# Altium schematic sheet Tubes.SchDoc
size A3; Size: A3; SheetNumber: 1; SheetTotal: 1
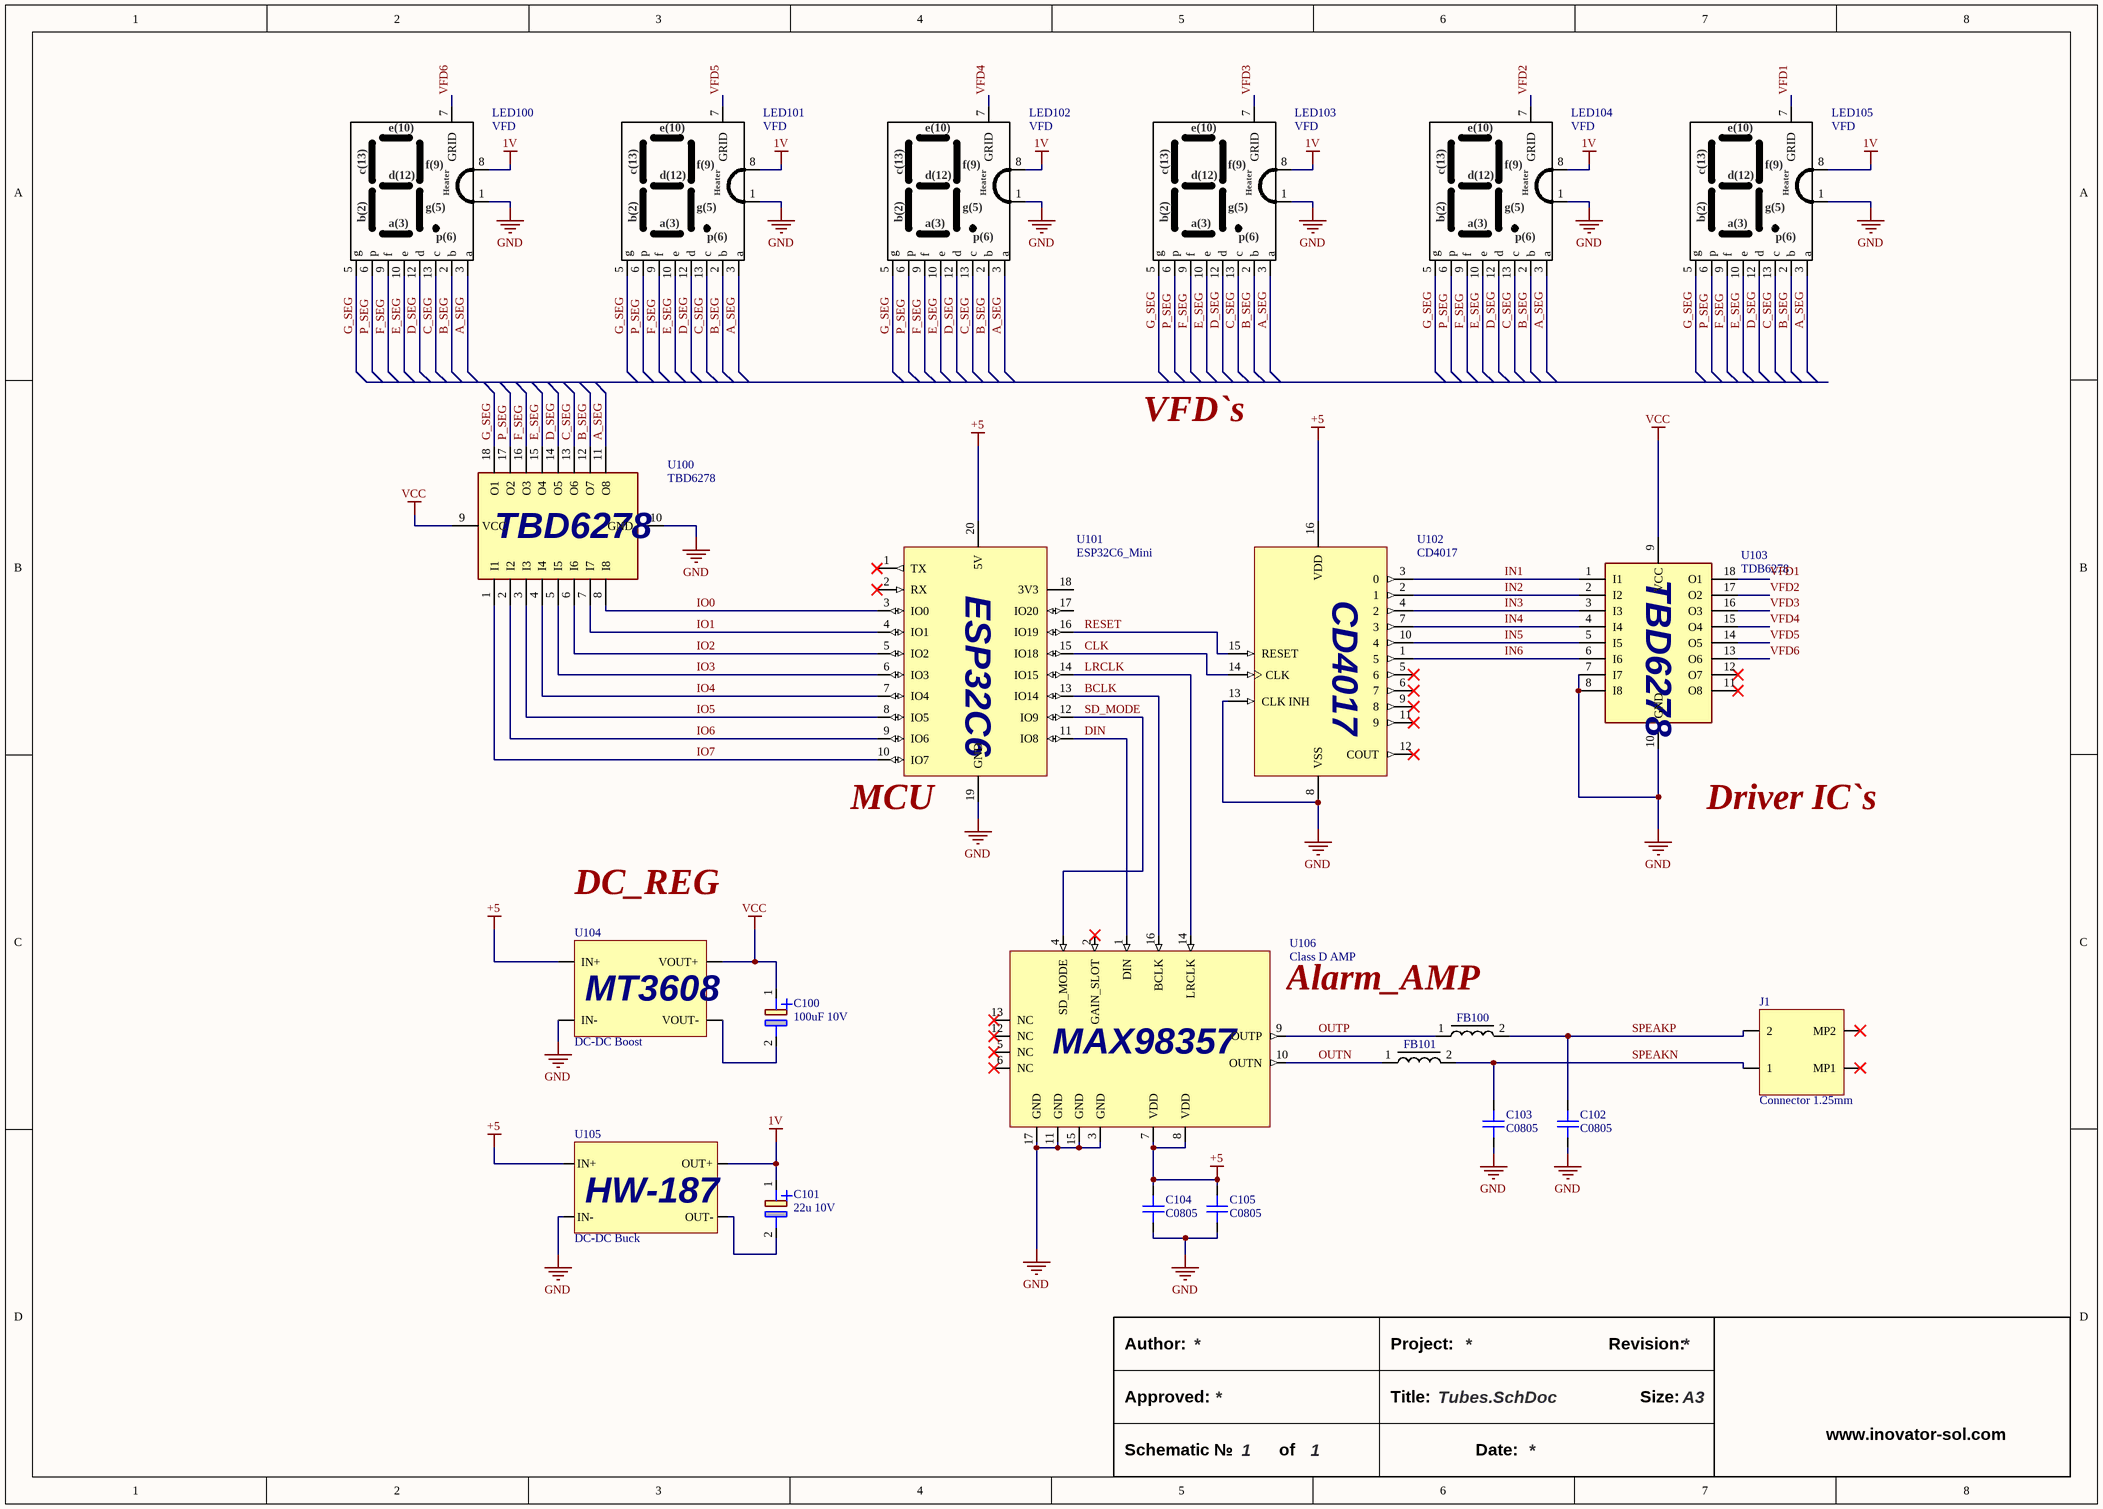
[diagram p0: Tubes.SchDoc]

## Parts
?  (no value)
C100  100uF 10V  [CAP_100u_10V_PRD250W50D630H800]
C101  22u 10V  [CAP_D4mm_LS1.5mm]
C102  C0805  [CAP_0805]
C103  C0805  [CAP_0805]
C104  C0805  [CAP_0805]
C105  C0805  [CAP_0805]
FB100  FB0805  Ω  [FB_0805]  (value not drawn)
FB101  FB0805  Ω  [FB_0805]  (value not drawn)
J1  Connector 1.25mm  [532610271]
LED100  VFD  [VFD_Tube_IV3]
LED101  VFD  [VFD_Tube_IV3]
LED102  VFD  [VFD_Tube_IV3]
LED103  VFD  [VFD_Tube_IV3]
LED104  VFD  [VFD_Tube_IV3]
LED105  VFD  [VFD_Tube_IV3]
U100  TBD6278  [TBD62783_DIP762W55P254L2286H480Q18N]
U101  ESP32C6_Mini  [ESP32_minimodule - duplicate]
U102  CD4017  [CD4017_N0016A]
U103  TDB6278  [TBD62783_DIP762W55P254L2286H480Q18N]
U104  DC-DC Boost  [boost_mt3608]
U105  DC-DC Buck  [HW-187]
U106  Class D AMP  [TQFN-16_MAX98357]

## Nets
1V: C101.1(+) LED100.8 LED101.8 LED102.8 LED103.8 LED104.8 LED105.8 U105.3(OUT+)
+5: C104.2 C105.2 U101.20(5V) U102.16(VDD) U104.2(IN+) U105.1(IN+) U106.7(VDD) U106.8(VDD)
GND: C102.1 C103.1 C104.1 C105.1 LED100.1 LED101.1 LED102.1 LED103.1 LED104.1 LED105.1 U100.10(GND) U101.19(GND) U102.8(VSS) U102.13(CLK_INH) U103.7(I7) U103.8(I8) U103.10(GND) U104.1(IN-) U105.2(IN-) U106.3(GND) U106.11(GND) U106.15(GND) U106.17(GND)
VCC: C100.1(+) U100.9(VCC) U103.9(VCC) U104.3(VOUT+)
A_SEG: LED100.3(a) LED101.3(a) LED102.3(a) LED103.3(a) LED104.3(a) LED105.3(a) U100.11(O8)
B_SEG: LED100.2(b) LED101.2(b) LED102.2(b) LED103.2(b) LED104.2(b) LED105.2(b) U100.12(O7)
BCLK: U101.13(IO14) U106.16(BCLK)
C_SEG: LED100.13(c) LED101.13(c) LED102.13(c) LED103.13(c) LED104.13(c) LED105.13(c) U100.13(O6)
CLK: U101.15(IO18) U102.14(CLK)
D_SEG: LED100.12(d) LED101.12(d) LED102.12(d) LED103.12(d) LED104.12(d) LED105.12(d) U100.14(O5)
DIN: U101.11(IO8) U106.1(DIN)
E_SEG: LED100.10(e) LED101.10(e) LED102.10(e) LED103.10(e) LED104.10(e) LED105.10(e) U100.15(O4)
F_SEG: LED100.9(f) LED101.9(f) LED102.9(f) LED103.9(f) LED104.9(f) LED105.9(f) U100.16(O3)
G_SEG: LED100.5(g) LED101.5(g) LED102.5(g) LED103.5(g) LED104.5(g) LED105.5(g) U100.18(O1)
IN1: U102.3(0) U103.1(I1)
IN2: U102.2(1) U103.2(I2)
IN3: U102.4(2) U103.3(I3)
IN4: U102.7(3) U103.4(I4)
IN5: U102.10(4) U103.5(I5)
IN6: U102.1(5) U103.6(I6)
IO0: U100.8(I8) U101.3(IO0)
IO1: U100.7(I7) U101.4(IO1)
IO2: U100.6(I6) U101.5(IO2)
IO3: U100.5(I5) U101.6(IO3)
IO4: U100.4(I4) U101.7(IO4)
IO5: U100.3(I3) U101.8(IO5)
IO6: U100.2(I2) U101.9(IO6)
IO7: U100.1(I1) U101.10(IO7)
LRCLK: U101.14(IO15) U106.14(LRCLK)
OUTN: FB101.1 U106.10(OUTN)
OUTP: FB100.1 U106.9(OUTP)
P_SEG: LED100.6(p) LED101.6(p) LED102.6(p) LED103.6(p) LED104.6(p) LED105.6(p) U100.17(O2)
RESET: U101.16(IO19) U102.15(RESET)
SD_MODE: U101.12(IO9) U106.4(SD_MODE)
SPEAKN: C103.2 FB101.2 J1.1
SPEAKP: C102.2 FB100.2 J1.2
VFD1: LED105.7(GRID) U103.18(O1)
VFD2: LED104.7(GRID) U103.17(O2)
VFD3: LED103.7(GRID) U103.16(O3)
VFD4: LED102.7(GRID) U103.15(O4)
VFD5: LED101.7(GRID) U103.14(O5)
VFD6: LED100.7(GRID) U103.13(O6)
NetC100_2: C100.2(-) U104.4(VOUT-)
NetC101_2: C101.2(-) U105.4(OUT-)

Not connected (* = marked no-connect by the designer): J1 MP1* MP2*; U101 1(TX)* 2(RX)* 17(IO20) 18(3V3); U102 5(6)* 6(7)* 9(8)* 11(9)* 12(COUT)*; U103 11(O8)* 12(O7)*; U106 2(GAIN_SLOT)* 5(NC)* 6(NC)* 12(NC)* 13(NC)*

## Notes on the sheet
- VFD`s
- (near U101) MCU
- Driver IC`s
- DC_REG
- (near U106) Alarm_AMP
- Author:
- Project:
- Revision:
- Approved:
- Schematic №
- of
- Title:
- Date:
- Size:
- www.inovator-sol.com <http://www.inovator-sol.com>
- (in symbol ESP32C6_mini_module) ESP32C6
- (in symbol MAX98357AETE+T) MAX98357
- (in symbol MODULE_MT3608) MT3608
- (in symbol TBD62783APG) TBD6278
- (in symbol VFD_Tube_IV3) e(10); f(9); c(13); d(12); Heater; g(5); b(2); a(3); p(6)

## Library data of the parts
? = Title_Block_INOV_small: Title Block for A3 size sheet.
C100 = CAP_100u_10V: Cap Aluminum 100uF 10V 20% (6.3 X 7mm) Radial 2.5mm 80mA 1000 hr 85°C Bulk; Manufacturer: Panasonic; Manufacturer Part Number: ECE-A1AKA101; Supplier: Mouser; Supplier Part Number: 667-ECE-A1AKA101; RoHS: Yes; Category: Aluminum Electrolytic Capacitors; Stock: 46; Pricing: 1=0,21, 10=0,104, 50=0,104, 100=0,06, 1000=0,053, 10000=0,049 (USD); ComponentLink1URL: https://datasheet.ciiva.com/16390/aba0000ce20-16390502.pdf?src-supplier=Future+Electronics; ComponentLink1Description: https://datasheet.ciiva.com/16390/aba0000ce20-16390502.pdf?src-supplier=Future+Electronics; ComponentLink2URL: https://datasheet.ciiva.com/43459/1339511-43459559.pdf?src-supplier=Farnell; ComponentLink2Description: https://datasheet.ciiva.com/43459/1339511-43459559.pdf?src-supplier=Farnell; ComponentLink3URL: https://datasheet.ciiva.com/2984/aba0000ce20-2984487.pdf?src-supplier=Avnet; ComponentLink3Description: https://datasheet.ciiva.com/2984/aba0000ce20-2984487.pdf?src-supplier=Avnet; ComponentLink4URL: https://datasheet.ciiva.com/46397/1339511-46397446.pdf?src-supplier=Element14; ComponentLink4Description: https://datasheet.ciiva.com/46397/1339511-46397446.pdf?src-supplier=Element14
C101 = CAP_22u_10V_ECE-A1AKA220: Cap Aluminum 22uF 10V 20% Radial 1000h 85°C Bulk; Manufacturer: Panasonic; Supplier: Mouser; Supplier Part Number: 667-ECE-A1AKA220; Manufacturer Part Number: ECE-A1AKA220; RoHS: Yes; Category: Aluminum Electrolytic Capacitors; Stock: 1909; Pricing: 1=0,29, 10=0,136, 50=0,136, 100=0,071, 1000=0,056, 10000=0,044 (USD); ComponentLink1URL: https://datasheet.ciiva.com/46451/1339511-46451258.pdf?src-supplier=Element14; ComponentLink1Description: https://datasheet.ciiva.com/46451/1339511-46451258.pdf?src-supplier=Element14; ComponentLink2URL: https://datasheet.ciiva.com/30183/aba0000ce20-30183486.pdf?src-supplier=Onlinecomponents.com; ComponentLink2Description: https://datasheet.ciiva.com/30183/aba0000ce20-30183486.pdf?src-supplier=Onlinecomponents.com; ComponentLink3URL: https://datasheet.ciiva.com/2984/aba0000ce20-2984488.pdf?src-supplier=Avnet; ComponentLink3Description: https://datasheet.ciiva.com/2984/aba0000ce20-2984488.pdf?src-supplier=Avnet
C102-C105 = CAP_0805: Capacitor SMD 0805; Manufacturer: *; Manufacturer Part Number: *; Distributor Link: *; LCSC: *; Rating: *; Dielectric: *
FB100 FB101 = FB_0805: Ferrite Bead SMD 0805; Manufacturer: *; Manufacturer Part Number: *; Distributor Link: *; LCSC: *
J1 = 53261-0271: 1.25mm Pitch PicoBlade™ Header, Surface Mount, Right Angle, Lead-Free, 2 Circuits; Manufacturer: Molex; Manufacturer Lifecycle Status: ACTIVE; Contact Resistance: 20mΩ; Current Rating: 5.5A; Gender: Male; Glow Wire Compliant: Non-compliant; Insulation Resistance: 100MΩ; Number of Circuits: 2; Plating: Tin; Plating Thickness: 990.6nm; Voltage Rating: 125V; Supplier: Mouser; Supplier Part Number: 538-53261-0271; Manufacturer Part Number: 53261-0271; RoHS: Compliant; Category: Headers and Wire Housings; Stock: 82573; Pricing: 1=0,51, 10=0,455, 50=0,436, 100=0,387, 1000=0,301, 10000=0,27 (USD); China RoHS: Compliant; Color: Beige; Contact Gender: Male; Contact Plating: Tin; Country of Origin: SG; Flammability Rating: UL94 V-0; Height: 3.4mm; Housing Material: Nylon; Lead Free: Lead Free; Lead Pitch: 1.25mm; Length: 7.65mm; Lifecycle Status: Production; Max Operating Temperature: 105°C; Min Operating Temperature: -40°C; Mounting Technology: Surface Mount; Number of Contacts: 2; Pins: 2; Number of Positions: 2; Number of Rows: 1; Orientation: Right Angle; Packaging: Cut Tape; Pitch: 1.25mm; Radiation Hardening: No; REACH SVHC: Yes; Schedule B: 8536694040, 8536694040|8536694040|8536694040|8536694040|8536694040|8536694040|8536694040|8536694040|8536694040|8536694040|8536694040|8536694040|8536694040|8536694040|8536694040|8536694040|8536694040|8536694040|8536694040|8536694040|8536694040|8536694040|8536694040|85; Terminal Pitch: 1.25mm; Termination: SMD/SMT, Solder; Voltage Rating (AC): 125V; Voltage Rating (DC): 125V; Width: 4.2mm; Working Voltage: 125V; ComponentLink1URL: https://datasheet.octopart.com:443/53261-0271-Molex-datasheet-8522546.pdf?src-supplier=Master+Electronics; ComponentLink1Description: https://datasheet.octopart.com:443/53261-0271-Molex-datasheet-8522546.pdf?src-supplier=Master+Electronics; ComponentLink2URL: https://datasheet.octopart.com:443/53261-0271-Molex-datasheet-177725531.pdf?src-supplier=IHS; ComponentLink2Description: https://datasheet.octopart.com:443/53261-0271-Molex-datasheet-177725531.pdf?src-supplier=IHS; ComponentLink3URL: https://datasheet.octopart.com:443/53261-0271-Molex-datasheet-8343080.pdf?src-supplier=Future+Electronics; ComponentLink3Description: https://datasheet.octopart.com:443/53261-0271-Molex-datasheet-8343080.pdf?src-supplier=Future+Electronics; ComponentLink4URL: https://datasheet.octopart.com:443/532610271-Molex-datasheet-137316104.pdf?src-supplier=Future+Electronics; ComponentLink4Description: https://datasheet.octopart.com:443/532610271-Molex-datasheet-137316104.pdf?src-supplier=Future+Electronics; ComponentLink5URL: https://datasheet.octopart.com:443/53261-0271-Molex-datasheet-8331727.pdf?src-supplier=Molex; ComponentLink5Description: https://datasheet.octopart.com:443/53261-0271-Molex-datasheet-8331727.pdf?src-supplier=Molex; ComponentLink6URL: https://sigma.octopart.com:443/16413759/technical_drawing/Molex-532610271.pdf?src-supplier=Molex; ComponentLink6Description: https://sigma.octopart.com:443/16413759/technical_drawing/Molex-532610271.pdf?src-supplier=Molex; ComponentLink7URL: https://datasheet.octopart.com:443/532610271-Molex-datasheet-13786009.pdf?src-supplier=Sager+Electronics; ComponentLink7Description: https://datasheet.octopart.com:443/532610271-Molex-datasheet-13786009.pdf?src-supplier=Sager+Electronics; ComponentLink8URL: https://datasheet.octopart.com:443/53261-0271-Molex-datasheet-14711292.pdf?src-supplier=element14+APAC; ComponentLink8Description: https://datasheet.octopart.com:443/53261-0271-Molex-datasheet-14711292.pdf?src-supplier=element14+APAC; ComponentLink9URL: https://datasheet.octopart.com:443/53261-0271-Molex-datasheet-101583399.pdf?src-supplier=Farnell; ComponentLink9Description: https://datasheet.octopart.com:443/53261-0271-Molex-datasheet-101583399.pdf?src-supplier=Farnell; ComponentLink10URL: https://datasheet.octopart.com:443/53261-0271.-Molex-datasheet-77558175.pdf?src-supplier=Farnell; ComponentLink10Description: https://datasheet.octopart.com:443/53261-0271.-Molex-datasheet-77558175.pdf?src-supplier=Farnell; ComponentLink11URL: https://datasheet.octopart.com:443/53261-0271-Molex-datasheet-11023919.pdf?src-supplier=Farnell; ComponentLink11Description: https://datasheet.octopart.com:443/53261-0271-Molex-datasheet-11023919.pdf?src-supplier=Farnell; ComponentLink12URL: https://datasheet.octopart.com:443/532610271-Molex-datasheet-520094.pdf?src-supplier=Farnell; ComponentLink12Description: https://datasheet.octopart.com:443/532610271-Molex-datasheet-520094.pdf?src-supplier=Farnell; ComponentLink13URL: https://datasheet.octopart.com:443/53261-0271-Molex-datasheet-41177771.pdf?src-supplier=Newark; ComponentLink13Description: https://datasheet.octopart.com:443/53261-0271-Molex-datasheet-41177771.pdf?src-supplier=Newark; ComponentLink14URL: https://datasheet.octopart.com:443/53261-0271-Molex-datasheet-27120403.pdf?src-supplier=Newark; ComponentLink14Description: https://datasheet.octopart.com:443/53261-0271-Molex-datasheet-27120403.pdf?src-supplier=Newark; ComponentLink15URL: https://datasheet.octopart.com:443/53261-0271-Molex-datasheet-140186584.pdf?src-supplier=RS+(Formerly+Allied+Electronics); ComponentLink15Description: https://datasheet.octopart.com:443/53261-0271-Molex-datasheet-140186584.pdf?src-supplier=RS+(Formerly+Allied+Electronics); ComponentLink16URL: https://datasheet.octopart.com:443/53261-0271-Molex-datasheet-120153897.pdf?src-supplier=RS+(Formerly+Allied+Electronics); ComponentLink16Description: https://datasheet.octopart.com:443/53261-0271-Molex-datasheet-120153897.pdf?src-supplier=RS+(Formerly+Allied+Electronics); ComponentLink17URL: https://datasheet.octopart.com:443/53261-0271-Molex-datasheet-34442330.pdf?src-supplier=RS+(Formerly+Allied+Electronics); ComponentLink17Description: https://datasheet.octopart.com:443/53261-0271-Molex-datasheet-34442330.pdf?src-supplier=RS+(Formerly+Allied+Electronics); ComponentLink18URL: https://datasheet.octopart.com:443/53261-0271-Molex-datasheet-27710088.pdf?src-supplier=RS+(Formerly+Allied+Electronics); ComponentLink18Description: https://datasheet.octopart.com:443/53261-0271-Molex-datasheet-27710088.pdf?src-supplier=RS+(Formerly+Allied+Electronics); ComponentLink19URL: https://datasheet.octopart.com:443/53261-0271-Molex-datasheet-62281348.pdf?src-supplier=Electro+Sonic; ComponentLink19Description: https://datasheet.octopart.com:443/53261-0271-Molex-datasheet-62281348.pdf?src-supplier=Electro+Sonic; ComponentLink20URL: https://datasheet.octopart.com:443/53261-0271-Molex-datasheet-23710575.pdf?src-supplier=Electro+Sonic; ComponentLink20Description: https://datasheet.octopart.com:443/53261-0271-Molex-datasheet-23710575.pdf?src-supplier=Electro+Sonic; ComponentLink21URL: https://datasheet.octopart.com:443/53261-0271-Molex-datasheet-26579557.pdf?src-supplier=TME; ComponentLink21Description: https://datasheet.octopart.com:443/53261-0271-Molex-datasheet-26579557.pdf?src-supplier=TME; ComponentLink22URL: https://datasheet.octopart.com:443/53261-0271-Molex-datasheet-17741841.pdf?src-supplier=Jameco; ComponentLink22Description: https://datasheet.octopart.com:443/53261-0271-Molex-datasheet-17741841.pdf?src-supplier=Jameco; ComponentLink23URL: https://datasheet.octopart.com:443/53261-0271-Molex-datasheet-144901.pdf?src-supplier=DigiKey; ComponentLink23Description: https://datasheet.octopart.com:443/53261-0271-Molex-datasheet-144901.pdf?src-supplier=DigiKey; ComponentLink24URL: https://datasheet.octopart.com:443/532-61-0271-Molex-datasheet-100429.pdf?src-supplier=element14; ComponentLink24Description: https://datasheet.octopart.com:443/532-61-0271-Molex-datasheet-100429.pdf?src-supplier=element14; ComponentLink25URL: http://sigma.octopart.com:80/16413755/rohs_statement/Molex-532610271.pdf?src-supplier=Compliance+Statements; ComponentLink25Description: http://sigma.octopart.com:80/16413755/rohs_statement/Molex-532610271.pdf?src-supplier=Compliance+Statements; ComponentLink26URL: http://sigma.octopart.com:80/conflict_mineral_statement/Molex-company-72.pdf?src-supplier=Compliance+Statements; ComponentLink26Description: http://sigma.octopart.com:80/conflict_mineral_statement/Molex-company-72.pdf?src-supplier=Compliance+Statements; ComponentLink27URL: http://sigma.octopart.com:80/rohs_statement/Molex-company-73.pdf?src-supplier=Compliance+Statements; ComponentLink27Description: http://sigma.octopart.com:80/rohs_statement/Molex-company-73.pdf?src-supplier=Compliance+Statements; ComponentLink28URL: http://sigma.octopart.com:80/reach_statement/Molex-company-74.pdf?src-supplier=Compliance+Statements; ComponentLink28Description: http://sigma.octopart.com:80/reach_statement/Molex-company-74.pdf?src-supplier=Compliance+Statements
LED100-LED105 = VFD_Tube_IV3: 96x10.6 mm
U100 U103 = TBD62783APG: Buffer/Inverter Based Peripheral Driver, 1 Driver, 0.4A, DMOS, PDIP18; Manufacturer: Toshiba; Interface: On/Off; Max Output current: 400mA; Max Supply Current: 1.5mA; Max Supply Voltage: 50V; Min Supply Voltage: 2V; Number of Channels: 8; Number of Transmitters: 1; Operating Supply Voltage: 5V; Output Configuration: High Side; Supplier: Mouser; Supplier Part Number: 757-TBD62783APG; Manufacturer Part Number: TBD62783APG; RoHS: Compliant; Category: Power Switch ICs - Power Distribution; Stock: 7346; Pricing: 1=2,34, 10=1,46, 50=1,4, 100=1,35, 1000=1,24, 10000=1,19 (USD); Case/Package: DIP; Height - Seated (Max): 4.8mm; Length: 22.86mm; Lifecycle Status: Production; Max Operating Temperature: 85°C; Min Operating Temperature: -40°C; Number of Circuits: 8; Number of Outputs: 8; Number of Terminals: 18; Output Voltage: 50V; Terminal Pitch: 2.54mm; Width: 7.62mm; ComponentLink1URL: https://datasheet.octopart.com:443/TBD62783APG-Toshiba-datasheet-68329876.pdf?src-supplier=IHS; ComponentLink1Description: https://datasheet.octopart.com:443/TBD62783APG-Toshiba-datasheet-68329876.pdf?src-supplier=IHS; Supplier 1: Mouser; Supplier Part Number 1: 757-TBD62783APG
U101 = ESP32C6_mini_module: ESP32-C6 Super Mini is a development board based on the ESP32C6 microcontroller using RISCV32 architecture.
U102 = CD4017BE: Counter; PDIP; Counter Logic; 3 V to 18 V; -55; +125; 0.04 Ua to 0.08 Ua Icc; 5; Manufacturer: Texas Instruments; Manufacturer Lifecycle Status: ACTIVE; Clock Edge Trigger Type: Positive Edge; Direction: Unidirectional; Frequency: 11MHz; Max Supply Voltage: 18V; Min Supply Voltage: 3V; Number of Bits: 4; Number of Bits per Element: 10; Number of Elements: 1; Output Current: 1.5mA; Propagation Delay: 650ns; Quiescent Current: 100µA; Reset: Asynchronous; Sync/Async: Synchronous; Supplier: Mouser; Supplier Part Number: 595-CD4017BE; Manufacturer Part Number: CD4017BE; RoHS: Compliant; Category: Counters; Stock: 2110; Pricing: 1=1,27, 10=0,925, 50=0,837, 100=0,741, 1000=0,621, 10000=0,581 (USD); Case/Package: PDIP; Contact Plating: Gold; Height: 5.08mm; Lead Free: Lead Free; Length: 19.3mm; Lifecycle Status: Production; Logic Function: Counter; Max Operating Temperature: 125°C; Min Operating Temperature: -55°C; Mounting Technology: Through Hole; Number of Gates: 1; Pins: 16; Radiation Hardening: No; REACH SVHC: No; Schedule B: 8542390000, 8542390000|8542390000, 8542390000|8542390000|8542390000, 8542390000|8542390000|8542390000|8542390000; Thickness: 3.9mm; Turn-On Delay Time: 650ns; Weight: 951.693491mg; Width: 6.35mm; ComponentLink1URL: https://datasheet.octopart.com:443/CD4017BE-Texas-Instruments-datasheet-10748468.pdf?src-supplier=Texas+Instruments; ComponentLink1Description: https://datasheet.octopart.com:443/CD4017BE-Texas-Instruments-datasheet-10748468.pdf?src-supplier=Texas+Instruments; ComponentLink2URL: https://octopart.com:443/opatz8j6/c1?t=3k2FlkM7OhGjdAJw6uhZRZPpAud7BMHweqXBytVZhQ-0jhG-GAdzlQ4I78FykeNzveRZRDiGEnOmJnlwhDAerQ7XerPQbRk9ZqJ8fh-JFk-NBA_p0G_aRaaikVjBOZGi7BDezEpwyn-qNc3O93cQt2BGGu1pbCULKfXSuZMFyH5194iACgutjtV10PeKfw8KVSf5UBK_cxFLQcQ_Dtbuyq01eNVVbC8C7D4Gu-3dAmmUk6EMk2ugf-3GnxnOYLmcxrl3Pf1NzwrCKC19ARxoh0WAkbMHR5DniOKtLLlwzOi4JBiMm2AJRkW_uFf62YSIH4NIdhS5Tqbpb7I73gYwReX-DItx6qbwlRk52w0fSslDk6iutyacFAlz__RbBUseuw&src-supplier=Texas+Instruments; ComponentLink2Description: https://octopart.com:443/opatz8j6/c1?t=3k2FlkM7OhGjdAJw6uhZRZPpAud7BMHweqXBytVZhQ-0jhG-GAdzlQ4I78FykeNzveRZRDiGEnOmJnlwhDAerQ7XerPQbRk9ZqJ8fh-JFk-NBA_p0G_aRaaikVjBOZGi7BDezEpwyn-qNc3O93cQt2BGGu1pbCULKfXSuZMFyH5194iACgutjtV10PeKfw8KVSf5UBK_cxFLQcQ_Dtbuyq01eNVVbC8C7D4Gu-3dAmmUk6EMk2ugf-3GnxnOYLmcxrl3Pf1NzwrCKC19ARxoh0WAkbMHR5DniOKtLLlwzOi4JBiMm2AJRkW_uFf62YSIH4NIdhS5Tqbpb7I73gYwReX-DItx6qbwlRk52w0fSslDk6iutyacFAlz__RbBUseuw&src-supplier=Texas+Instruments; ComponentLink3URL: https://datasheet.octopart.com:443/CD4017BE-Texas-Instruments-datasheet-10257688.pdf?src-supplier=Texas+Instruments; ComponentLink3Description: https://datasheet.octopart.com:443/CD4017BE-Texas-Instruments-datasheet-10257688.pdf?src-supplier=Texas+Instruments; ComponentLink4URL: https://datasheet.octopart.com:443/CD4017BE-Texas-Instruments-datasheet-151115.pdf?src-supplier=Texas+Instruments; ComponentLink4Description: https://datasheet.octopart.com:443/CD4017BE-Texas-Instruments-datasheet-151115.pdf?src-supplier=Texas+Instruments; ComponentLink5URL: https://sigma.octopart.com:443/49249812/technical_drawing/Texas-Instruments-CD4017BE.pdf?src-supplier=Texas+Instruments; ComponentLink5Description: https://sigma.octopart.com:443/49249812/technical_drawing/Texas-Instruments-CD4017BE.pdf?src-supplier=Texas+Instruments; ComponentLink6URL: https://datasheet.octopart.com:443/CD4017BE-Texas-Instruments-datasheet-47642656.pdf?src-supplier=element14+APAC; ComponentLink6Description: https://datasheet.octopart.com:443/CD4017BE-Texas-Instruments-datasheet-47642656.pdf?src-supplier=element14+APAC; ComponentLink7URL: https://datasheet.octopart.com:443/CD4017BE-Texas-Instruments-datasheet-102486847.pdf?src-supplier=element14+APAC; ComponentLink7Description: https://datasheet.octopart.com:443/CD4017BE-Texas-Instruments-datasheet-102486847.pdf?src-supplier=element14+APAC; ComponentLink8URL: https://datasheet.octopart.com:443/CD4017BE-Texas-Instruments-datasheet-27379339.pdf?src-supplier=Farnell; ComponentLink8Description: https://datasheet.octopart.com:443/CD4017BE-Texas-Instruments-datasheet-27379339.pdf?src-supplier=Farnell; ComponentLink9URL: https://datasheet.octopart.com:443/CD4017BE-Texas-Instruments-datasheet-21412874.pdf?src-supplier=Farnell; ComponentLink9Description: https://datasheet.octopart.com:443/CD4017BE-Texas-Instruments-datasheet-21412874.pdf?src-supplier=Farnell; ComponentLink10URL: https://datasheet.octopart.com:443/CD4017BE-Texas-Instruments-datasheet-31678.pdf?src-supplier=Newark; ComponentLink10Description: https://datasheet.octopart.com:443/CD4017BE-Texas-Instruments-datasheet-31678.pdf?src-supplier=Newark; ComponentLink11URL: https://datasheet.octopart.com:443/CD4017BE-Texas-Instruments-datasheet-177784054.pdf?src-supplier=Burklin+Elektronik; ComponentLink11Description: https://datasheet.octopart.com:443/CD4017BE-Texas-Instruments-datasheet-177784054.pdf?src-supplier=Burklin+Elektronik; ComponentLink12URL: https://datasheet.octopart.com:443/CD4017BE-Texas-Instruments-datasheet-164413264.pdf?src-supplier=SHENGYU+ELECTRONICS; ComponentLink12Description: https://datasheet.octopart.com:443/CD4017BE-Texas-Instruments-datasheet-164413264.pdf?src-supplier=SHENGYU+ELECTRONICS; ComponentLink13URL: https://datasheet.octopart.com:443/CD4017BE-Texas-Instruments-datasheet-160672318.pdf?src-supplier=LCSC; ComponentLink13Description: https://datasheet.octopart.com:443/CD4017BE-Texas-Instruments-datasheet-160672318.pdf?src-supplier=LCSC; ComponentLink14URL: https://datasheet.octopart.com:443/CD4017BE-Texas-Instruments-datasheet-159114753.pdf?src-supplier=LCSC; ComponentLink14Description: https://datasheet.octopart.com:443/CD4017BE-Texas-Instruments-datasheet-159114753.pdf?src-supplier=LCSC; ComponentLink15URL: https://datasheet.octopart.com:443/CD4017BE-Texas-Instruments-datasheet-14145910.pdf?src-supplier=iiiC; ComponentLink15Description: https://datasheet.octopart.com:443/CD4017BE-Texas-Instruments-datasheet-14145910.pdf?src-supplier=iiiC; ComponentLink16URL: https://datasheet.octopart.com:443/CD4017BE-Texas-Instruments-datasheet-8369086.pdf?src-supplier=element14; ComponentLink16Description: https://datasheet.octopart.com:443/CD4017BE-Texas-Instruments-datasheet-8369086.pdf?src-supplier=element14; ComponentLink17URL: https://datasheet.octopart.com:443/CD4017BE-Texas-Instruments-datasheet-5333222.pdf?src-supplier=Verical; ComponentLink17Description: https://datasheet.octopart.com:443/CD4017BE-Texas-Instruments-datasheet-5333222.pdf?src-supplier=Verical; ComponentLink18URL: https://datasheet.octopart.com:443/CD4017BE-Texas-Instruments-datasheet-7284308.pdf?src-supplier=Jameco; ComponentLink18Description: https://datasheet.octopart.com:443/CD4017BE-Texas-Instruments-datasheet-7284308.pdf?src-supplier=Jameco; ComponentLink19URL: https://datasheet.octopart.com:443/CD4017BE-Texas-Instruments-datasheet-98236.pdf?src-supplier=RS+(Formerly+Allied+Electronics); ComponentLink19Description: https://datasheet.octopart.com:443/CD4017BE-Texas-Instruments-datasheet-98236.pdf?src-supplier=RS+(Formerly+Allied+Electronics); ComponentLink20URL: https://datasheet.octopart.com:443/CD4017BE-Texas-Instruments-datasheet-115811.pdf?src-supplier=Sierra+IC; ComponentLink20Description: https://datasheet.octopart.com:443/CD4017BE-Texas-Instruments-datasheet-115811.pdf?src-supplier=Sierra+IC; ComponentLink21URL: http://sigma.octopart.com:80/conflict_mineral_statement/Texas-Instruments-company-63.pdf?src-supplier=Compliance+Statements; ComponentLink21Description: http://sigma.octopart.com:80/conflict_mineral_statement/Texas-Instruments-company-63.pdf?src-supplier=Compliance+Statements; ComponentLink22URL: http://sigma.octopart.com:80/reach_statement/Texas-Instruments-company-64.pdf?src-supplier=Compliance+Statements; ComponentLink22Description: http://sigma.octopart.com:80/reach_statement/Texas-Instruments-company-64.pdf?src-supplier=Compliance+Statements
U104 = MODULE_MT3608: Step-up Boost Converter MT3608 2A
U105 = HW-187: DC-DC 4.7V-23V to 1V-17V Buck Converter Step Down
U106 = MAX98357AETE+T: MAX98357A Series 5.5 V 3.2 W PCM Input Class D Mono Audio Power Amplifier - TQFN-16; Manufacturer: Analog Devices; Manufacturer Lifecycle Status: PRODUCTION; Max Junction Temperature (Tj): 150°C; Max Output current: 1.6A; Max Output Power: 3.2W; Max Power Dissipation: 1.666W; Max Supply Voltage: 5.5V; Min Supply Voltage: 2.5V; Number of Channels: 1; Power Supply Rejection Ratio (PSRR): 77dB; Voltage Gain: 15dB; Supplier: Farnell; Supplier Part Number: 2949165; Manufacturer Part Number: MAX98357AETE+T; RoHS: Compliant; Category: Amplifiers - Audio; Stock: 25775; Pricing: 1=3,17, 10=2,39, 25=2,19, 100=1,98, 250=1,86, 500=1,8 (EUR); Contact Plating: Tin; Height: 800µm; Lifecycle Status: Production; Max Operating Temperature: 85°C; Min Operating Temperature: -40°C; Mounting Technology: Surface Mount; Pins: 16; Output Power: 3.2W; Packaging: Tape & Reel; Radiation Hardening: No; Schedule B: 8542330000|8542330000|8542330000|8542330000|8542330000|8542330000|8542330000|8542330000|8542330000|8542330000|8542330000|8542330000|8542330000|8542330000|8542330000|8542330000|8542330000|8542330000|8542330000|8542330000|8542330000|8542330000|8542330000|85; ComponentLink1URL: https://octopart.com:443/opatz8j6/c1?t=jSSDwXK4rxkAGXwUFBueHrzywhHGVOV41g_sgXETpVIkv8Ksp9X3FLnB-JNrs6KkstM7iebvHU0uZ6rWIokKmX8Tcy-QKto-68anl9XHLjGbmXXxgcOpqgle2nWz5i2KCI6AOb8I36lcrSBTJi5dmiHrRAcD9qCXaf3TZ2UDe0p0qNbiSZFyZj_kACVaH05CxxbHgDKxkkh8YefDpjz86C_drTYHs14o_OjqZsmjRf_U9dVv5MhWnOSaCVsYyd7VEEqUj1308_EupIz63q-NlRhv2s02NtNZvB6pgWaXskreutUSh-JjzVb0AqE&src-supplier=Analog+Devices; ComponentLink1Description: https://octopart.com:443/opatz8j6/c1?t=jSSDwXK4rxkAGXwUFBueHrzywhHGVOV41g_sgXETpVIkv8Ksp9X3FLnB-JNrs6KkstM7iebvHU0uZ6rWIokKmX8Tcy-QKto-68anl9XHLjGbmXXxgcOpqgle2nWz5i2KCI6AOb8I36lcrSBTJi5dmiHrRAcD9qCXaf3TZ2UDe0p0qNbiSZFyZj_kACVaH05CxxbHgDKxkkh8YefDpjz86C_drTYHs14o_OjqZsmjRf_U9dVv5MhWnOSaCVsYyd7VEEqUj1308_EupIz63q-NlRhv2s02NtNZvB6pgWaXskreutUSh-JjzVb0AqE&src-supplier=Analog+Devices; ComponentLink2URL: https://datasheet.octopart.com:443/MAX98357AETE%2BT-Analog-Devices-datasheet-140103828.pdf?src-supplier=Upverter; ComponentLink2Description: https://datasheet.octopart.com:443/MAX98357AETE%2BT-Analog-Devices-datasheet-140103828.pdf?src-supplier=Upverter; ComponentLink3URL: https://datasheet.octopart.com:443/MAX98357AETE%2BT-Maxim-Integrated-datasheet-82537686.pdf?src-supplier=Upverter; ComponentLink3Description: https://datasheet.octopart.com:443/MAX98357AETE%2BT-Maxim-Integrated-datasheet-82537686.pdf?src-supplier=Upverter; ComponentLink4URL: https://sigma.octopart.com:443/141243535/technical_drawing/Maxim-Integrated-MAX98357AETE%2BT.pdf?src-supplier=Upverter; ComponentLink4Description: https://sigma.octopart.com:443/141243535/technical_drawing/Maxim-Integrated-MAX98357AETE%2BT.pdf?src-supplier=Upverter; ComponentLink5URL: https://datasheet.octopart.com:443/MAX98357AETE%2BT-Maxim-Integrated-datasheet-134531866.pdf?src-supplier=Augswan; ComponentLink5Description: https://datasheet.octopart.com:443/MAX98357AETE%2BT-Maxim-Integrated-datasheet-134531866.pdf?src-supplier=Augswan; ComponentLink6URL: https://sigma.octopart.com:443/140082349/technical_drawing/Maxim-Integrated-MAX98357AETE%2BT.pdf?src-supplier=ShanghaiCT; ComponentLink6Description: https://sigma.octopart.com:443/140082349/technical_drawing/Maxim-Integrated-MAX98357AETE%2BT.pdf?src-supplier=ShanghaiCT; ComponentLink7URL: https://datasheet.octopart.com/MAX98357AETE%2BT-Maxim-Integrated-datasheet-38886134.pdf; ComponentLink7Description: https://datasheet.octopart.com/MAX98357AETE%2BT-Maxim-Integrated-datasheet-38886134.pdf; ComponentLink8URL: https://datasheet.octopart.com:443/MAX98357AETE%2BT-Maxim-Integrated-datasheet-8516998.pdf?src-supplier=Future+Electronics; ComponentLink8Description: https://datasheet.octopart.com:443/MAX98357AETE%2BT-Maxim-Integrated-datasheet-8516998.pdf?src-supplier=Future+Electronics; ComponentLink9URL: http://sigma.octopart.com:80/conflict_mineral_statement/Analog-Devices-company-33.pdf?src-supplier=Compliance+Statements; ComponentLink9Description: http://sigma.octopart.com:80/conflict_mineral_statement/Analog-Devices-company-33.pdf?src-supplier=Compliance+Statements; ComponentLink10URL: http://sigma.octopart.com:80/conflict_mineral_statement/Maxim-Integrated-company-65.pdf?src-supplier=Compliance+Statements; ComponentLink10Description: http://sigma.octopart.com:80/conflict_mineral_statement/Maxim-Integrated-company-65.pdf?src-supplier=Compliance+Statements; ComponentLink11URL: http://sigma.octopart.com:80/rohs_statement/Maxim-Integrated-company-66.pdf?src-supplier=Compliance+Statements; ComponentLink11Description: http://sigma.octopart.com:80/rohs_statement/Maxim-Integrated-company-66.pdf?src-supplier=Compliance+Statements; ComponentLink12URL: http://sigma.octopart.com:80/reach_statement/Maxim-Integrated-company-67.pdf?src-supplier=Compliance+Statements; ComponentLink12Description: http://sigma.octopart.com:80/reach_statement/Maxim-Integrated-company-67.pdf?src-supplier=Compliance+Statements; ComponentLink13URL: https://octopart.com:443/opatz8j6/c1?t=ZQo3IuyQoDbGFdP4CniPs-Qp0yjZjdyMx_ZBvD41Li-m-oi7UUXrzXA15IwX2tZHuHwgyJUvSxQsK1O1f7wko09Fi4QWcoyLdlke-Sw9Ykoc7RBK7pVcbql_U8IcHmfopmV1DvOo7bq0DrEf72et6J2-D0rtM85o62v4YQH4Dfg97wQq-Hh2C9nDQL-hMTN4n5K6MzvejDsfd6tiUgbgpvHuuZYpyGFt_kGc4DtcDxQ6GUgamQa4armI8zRaSOOyAdIbmzXi8ZFlmgMnqA9oR8lDcjUYP2_yWEw6ce6NuEHopK_uj9iPCZCwIcA&src-supplier=Compliance+Statements; ComponentLink13Description: https://octopart.com:443/opatz8j6/c1?t=ZQo3IuyQoDbGFdP4CniPs-Qp0yjZjdyMx_ZBvD41Li-m-oi7UUXrzXA15IwX2tZHuHwgyJUvSxQsK1O1f7wko09Fi4QWcoyLdlke-Sw9Ykoc7RBK7pVcbql_U8IcHmfopmV1DvOo7bq0DrEf72et6J2-D0rtM85o62v4YQH4Dfg97wQq-Hh2C9nDQL-hMTN4n5K6MzvejDsfd6tiUgbgpvHuuZYpyGFt_kGc4DtcDxQ6GUgamQa4armI8zRaSOOyAdIbmzXi8ZFlmgMnqA9oR8lDcjUYP2_yWEw6ce6NuEHopK_uj9iPCZCwIcA&src-supplier=Compliance+Statements; Supplier 1: Mouser; Supplier Part Number 1: 700-MAX98357AETE+T